# Altium project Motion_Controller.PrjPCB (part 4 of 4)
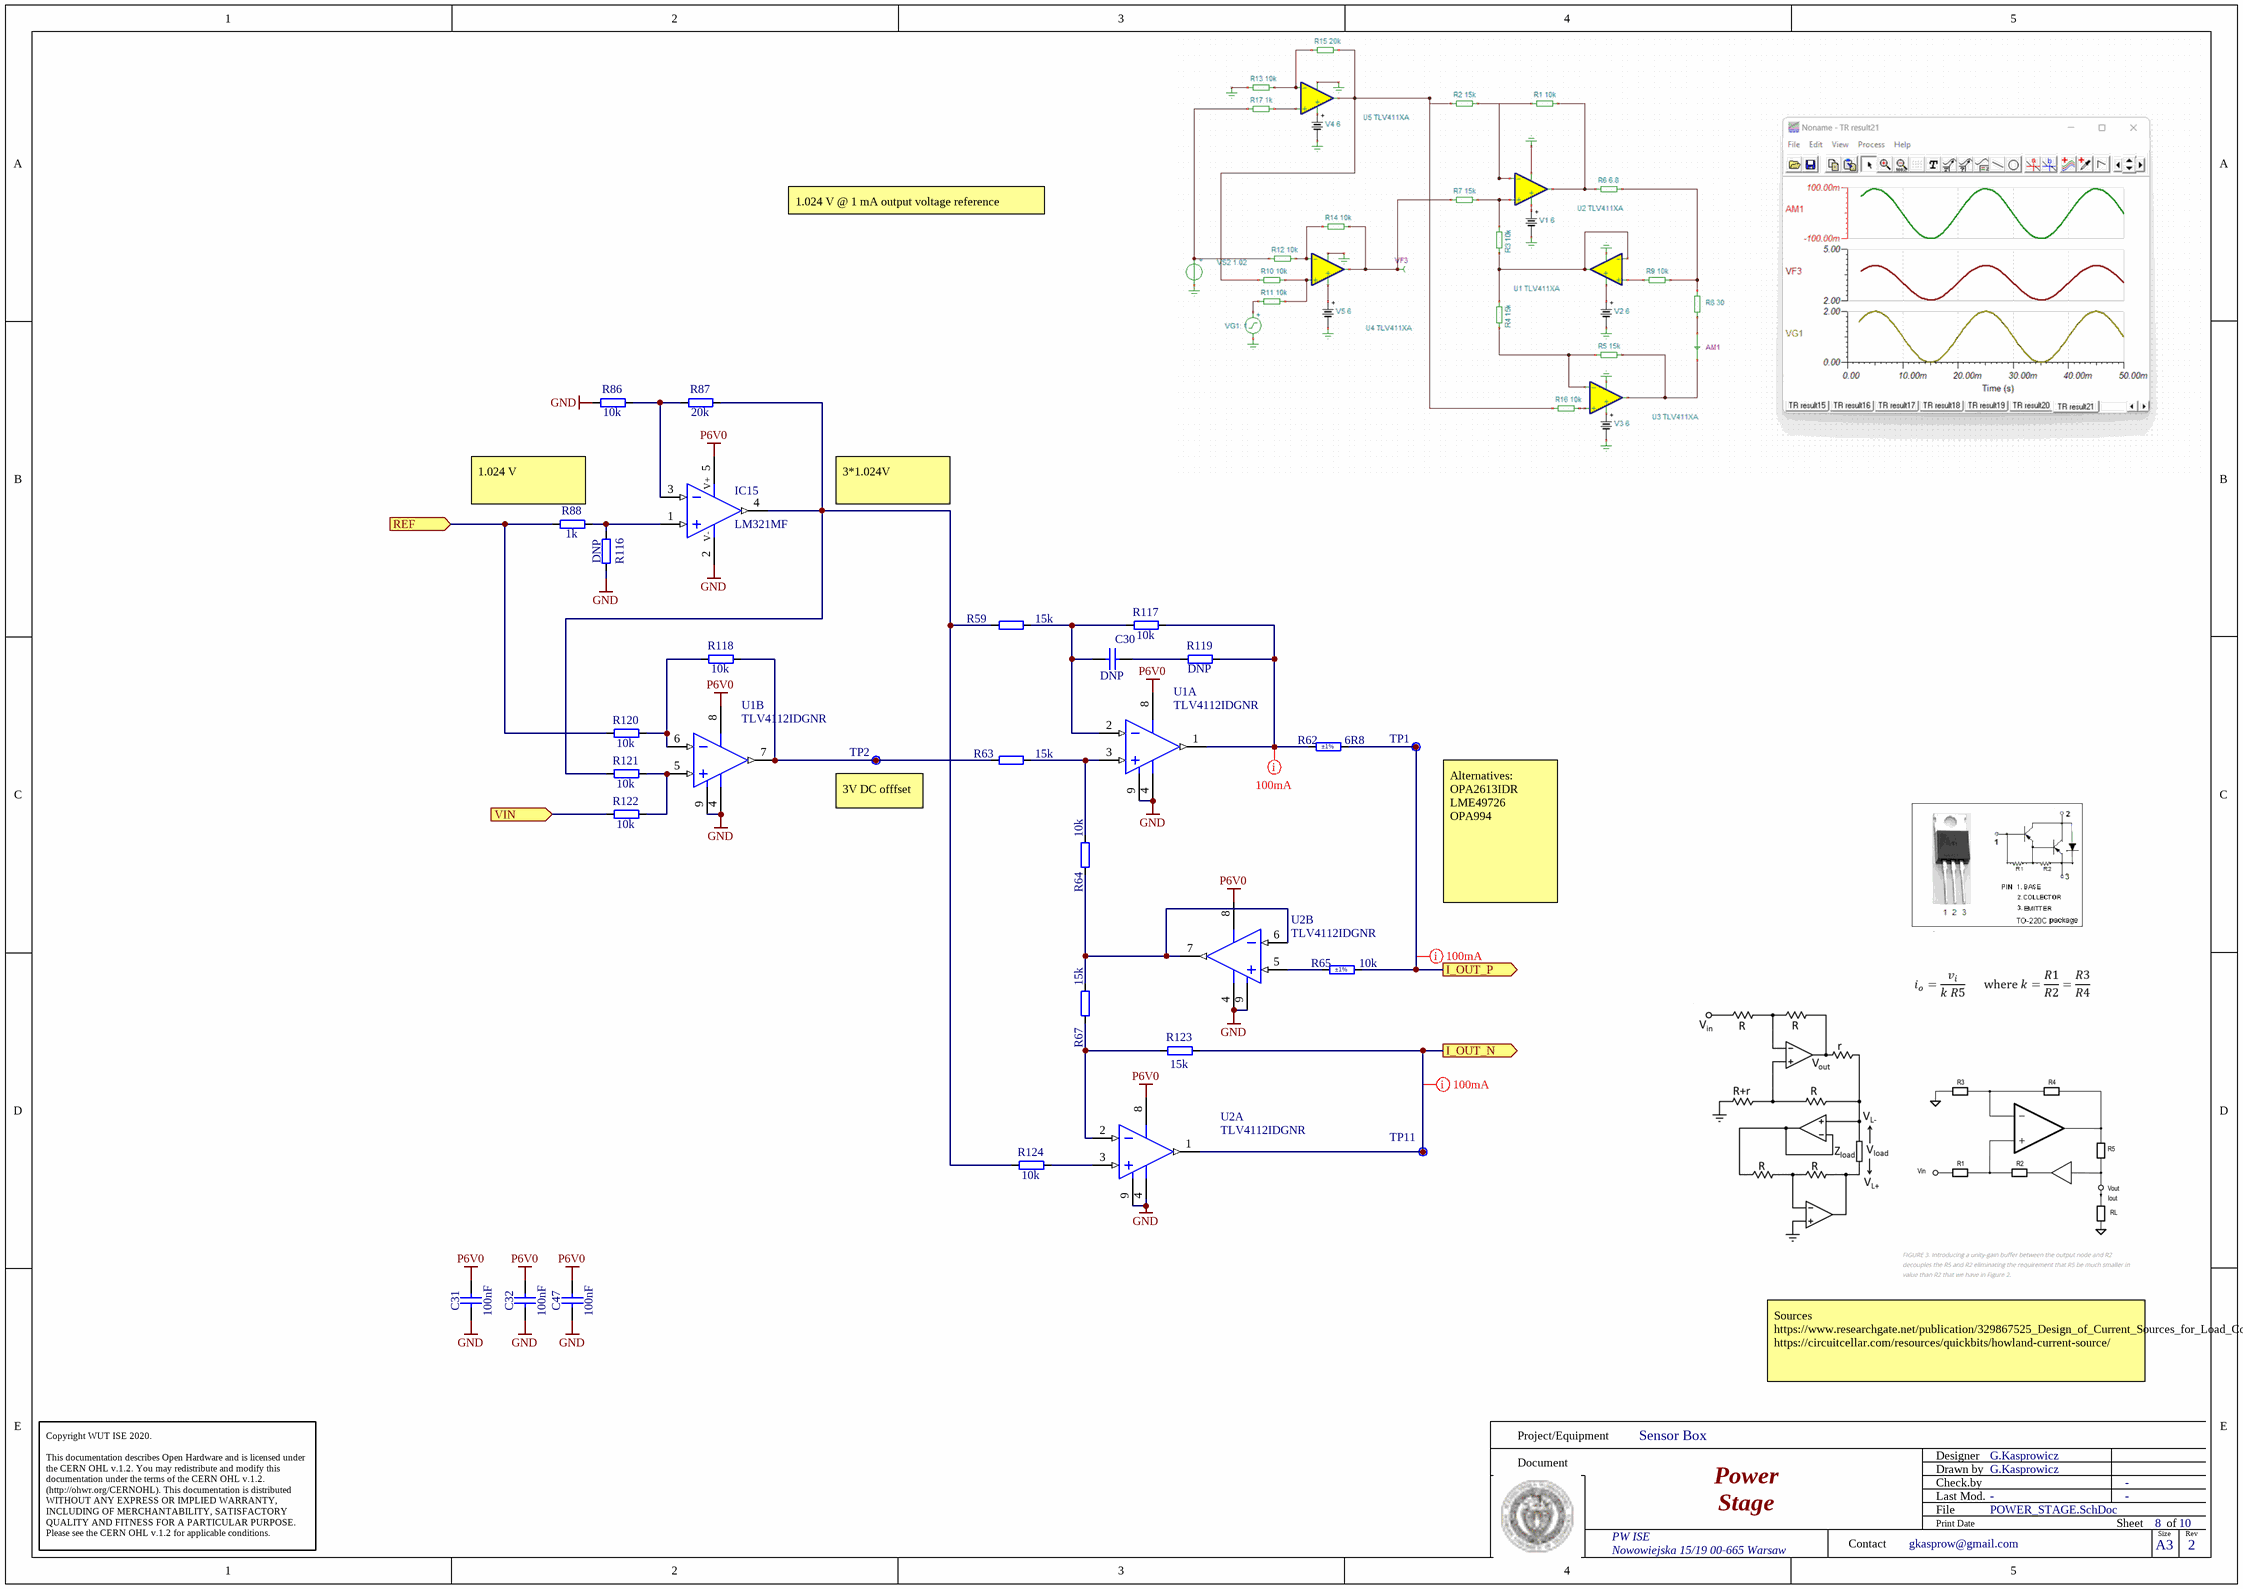
[diagram p11: POWER_STAGE.SchDoc]

## Nets that join several sheets
GND: TOP (6 pins), DAC1 (5 pins), DAC2 (5 pins), DAC3 (5 pins), DAC4 (5 pins), DAC5 (5 pins), DAC6 (5 pins), DAC7 (5 pins), DAC8 (5 pins), CMOD_A7 (14 pins), ARDUINO (12 pins), EEM_CONN (30 pins), DIOT_CONN (37 pins), POWER (34 pins), RJ45 (9 pins), U_RJ45/ENC1 (7 pins), U_RJ45/ENC2 (7 pins), U_RJ45/ENC3 (7 pins), U_RJ45/ENC4 (7 pins), U_RJ45/ENC5 (7 pins), U_RJ45/ENC6 (7 pins), U_RJ45/ENC7 (7 pins), U_RJ45/ENC8 (7 pins), SIN_CH1 (10 pins), SIN_CH2 (10 pins), SIN_CH3 (10 pins), SIN_CH4 (10 pins), SIN_CH5 (10 pins), SIN_CH6 (10 pins), SIN_CH7 (10 pins), SIN_CH8 (10 pins), COS_CH1 (10 pins), COS_CH2 (10 pins), COS_CH3 (10 pins), COS_CH4 (10 pins), COS_CH5 (10 pins), COS_CH6 (10 pins), COS_CH7 (10 pins), COS_CH8 (10 pins)
P3V3: TOP (LD5.2), DAC1 (C38A.2 U3A.8), DAC2 (C38B.2 U3B.8), DAC3 (C38C.2 U3C.8), DAC4 (C38D.2 U3D.8), DAC5 (C38E.2 U3E.8), DAC6 (C38F.2 U3F.8), DAC7 (C38G.2 U3G.8), DAC8 (C38H.2 U3H.8), CMOD_A7 (10 pins), ARDUINO (R99.2), EEM_CONN (8 pins), POWER (8 pins), U_RJ45/ENC1 (R79A.2), U_RJ45/ENC2 (R79B.2), U_RJ45/ENC3 (R79C.2), U_RJ45/ENC4 (R79D.2), U_RJ45/ENC5 (R79E.2), U_RJ45/ENC6 (R79F.2), U_RJ45/ENC7 (R79G.2), U_RJ45/ENC8 (R79H.2)
P3V3_CPCIS: DIOT_CONN (13 pins), POWER (5 pins)
P3V3_MP: TOP (R115.1), ARDUINO (D10.1 R98.2), EEM_CONN (15 pins), POWER (D6.1 D7.1)
P5V0: ARDUINO (R97.2), POWER (7 pins), U_RJ45/ENC1 (P1A.3 R77A.1), U_RJ45/ENC2 (P1B.3 R77B.1), U_RJ45/ENC3 (P1C.3 R77C.1), U_RJ45/ENC4 (P1D.3 R77D.1), U_RJ45/ENC5 (P1E.3 R77E.1), U_RJ45/ENC6 (P1F.3 R77F.1), U_RJ45/ENC7 (P1G.3 R77G.1), U_RJ45/ENC8 (P1H.3 R77H.1)
P6V0: ARDUINO (R84.2), DIOT_CONN (R60.1), POWER (6 pins), SIN_CH1 (6 pins), SIN_CH2 (6 pins), SIN_CH3 (6 pins), SIN_CH4 (6 pins), SIN_CH5 (6 pins), SIN_CH6 (6 pins), SIN_CH7 (6 pins), SIN_CH8 (6 pins), COS_CH1 (6 pins), COS_CH2 (6 pins), COS_CH3 (6 pins), COS_CH4 (6 pins), COS_CH5 (6 pins), COS_CH6 (6 pins), COS_CH7 (6 pins), COS_CH8 (6 pins)
P12V0: ARDUINO (R100.2), EEM_CONN (J2.28 J2.29 R37.1), POWER (11 pins), U_RJ45/ENC1 (C61A.2 IC17A.5), U_RJ45/ENC2 (C61B.2 IC17B.5), U_RJ45/ENC3 (C61C.2 IC17C.5), U_RJ45/ENC4 (C61D.2 IC17D.5), U_RJ45/ENC5 (C61E.2 IC17E.5), U_RJ45/ENC6 (C61F.2 IC17F.5), U_RJ45/ENC7 (C61G.2 IC17G.5), U_RJ45/ENC8 (C61H.2 IC17H.5)
P12V0_CPCIS: EEM_CONN (R37.2), DIOT_CONN (7 pins), POWER (C10.2 IC9.1 IC9.3)
ARDU_MISO: CMOD_A7 (IC13.19), ARDUINO (PCBM2.15)
ARDU_MOSI: CMOD_A7 (IC13.13), ARDUINO (PCBM2.14)
ARDU_MUX: CMOD_A7 (IC13.1 R74.2 R76.2), ARDUINO (PCBM2.7)
ARDU_MUX_OE: CMOD_A7 (IC13.10 R73.2 R75.2), ARDUINO (PCBM2.6)
ARDU_nCS: CMOD_A7 (IC13.11), ARDUINO (PCBM2.12)
ARDU_SCK: CMOD_A7 (IC13.17), ARDUINO (PCBM2.16)
BP_IO.LVDS_N0: EEM_CONN (R13.2), DIOT_CONN (J1.E3)
BP_IO.LVDS_N1: EEM_CONN (R15.2), DIOT_CONN (J1.B3)
BP_IO.LVDS_N2: EEM_CONN (R18.2), DIOT_CONN (J1.C4)
BP_IO.LVDS_N3: EEM_CONN (R22.2), DIOT_CONN (J1.L4)
BP_IO.LVDS_N4: EEM_CONN (R25.2), DIOT_CONN (J1.I4)
BP_IO.LVDS_N5: EEM_CONN (R27.2), DIOT_CONN (J1.K5)
BP_IO.LVDS_N6: EEM_CONN (R29.2), DIOT_CONN (J1.H5)
BP_IO.LVDS_N7: EEM_CONN (R33.2), DIOT_CONN (J1.F6)
BP_IO.LVDS_P0: EEM_CONN (R12.2), DIOT_CONN (J1.D3)
BP_IO.LVDS_P1: EEM_CONN (R14.2), DIOT_CONN (J1.A3)
BP_IO.LVDS_P2: EEM_CONN (R16.2), DIOT_CONN (J1.B4)
BP_IO.LVDS_P3: EEM_CONN (R20.2), DIOT_CONN (J1.K4)
BP_IO.LVDS_P4: EEM_CONN (R24.2), DIOT_CONN (J1.H4)
BP_IO.LVDS_P5: EEM_CONN (R26.2), DIOT_CONN (J1.J5)
BP_IO.LVDS_P6: EEM_CONN (R28.2), DIOT_CONN (J1.G5)
BP_IO.LVDS_P7: EEM_CONN (R32.2), DIOT_CONN (J1.E6)
DAC_DIN1: DAC1 (C35A.2 R70A.1 TP14A.1), CMOD_A7 (PCBM1.3)
DAC_DIN2: DAC2 (C35B.2 R70B.1 TP14B.1), CMOD_A7 (PCBM1.4)
DAC_DIN3: DAC3 (C35C.2 R70C.1 TP14C.1), CMOD_A7 (PCBM1.8)
DAC_DIN4: DAC4 (C35D.2 R70D.1 TP14D.1), CMOD_A7 (PCBM1.11)
DAC_DIN5: DAC5 (C35E.2 R70E.1 TP14E.1), CMOD_A7 (PCBM1.14)
DAC_DIN6: DAC6 (C35F.2 R70F.1 TP14F.1), CMOD_A7 (PCBM1.19)
DAC_DIN7: DAC7 (C35G.2 R70G.1 TP14G.1), CMOD_A7 (PCBM1.22)
DAC_DIN8: DAC8 (C35H.2 R70H.1 TP14H.1), CMOD_A7 (PCBM1.26)
DAC_nCS: TOP (TP16.1), DAC1 (C36A.2 R71A.1), DAC2 (C36B.2 R71B.1), DAC3 (C36C.2 R71C.1), DAC4 (C36D.2 R71D.1), DAC5 (C36E.2 R71E.1), DAC6 (C36F.2 R71F.1), DAC7 (C36G.2 R71G.1), DAC8 (C36H.2 R71H.1), CMOD_A7 (PCBM1.1)
DAC_OUTA1: DAC1 (TP13A.1 U3A.4), SIN_CH1 (R122A.1)
DAC_OUTA2: DAC2 (TP13B.1 U3B.4), SIN_CH2 (R122B.1)
DAC_OUTA3: DAC3 (TP13C.1 U3C.4), SIN_CH3 (R122C.1)
DAC_OUTA4: DAC4 (TP13D.1 U3D.4), SIN_CH4 (R122D.1)
DAC_OUTA5: DAC5 (TP13E.1 U3E.4), SIN_CH5 (R122E.1)
DAC_OUTA6: DAC6 (TP13F.1 U3F.4), SIN_CH6 (R122F.1)
DAC_OUTA7: DAC7 (TP13G.1 U3G.4), SIN_CH7 (R122G.1)
DAC_OUTA8: DAC8 (TP13H.1 U3H.4), SIN_CH8 (R122H.1)
DAC_OUTB1: DAC1 (TP15A.1 U3A.7), COS_CH1 (R122I.1)
DAC_OUTB2: DAC2 (TP15B.1 U3B.7), COS_CH2 (R122J.1)
DAC_OUTB3: DAC3 (TP15C.1 U3C.7), COS_CH3 (R122K.1)
DAC_OUTB4: DAC4 (TP15D.1 U3D.7), COS_CH4 (R122L.1)
DAC_OUTB5: DAC5 (TP15E.1 U3E.7), COS_CH5 (R122M.1)
DAC_OUTB6: DAC6 (TP15F.1 U3F.7), COS_CH6 (R122N.1)
DAC_OUTB7: DAC7 (TP15G.1 U3G.7), COS_CH7 (R122O.1)
DAC_OUTB8: DAC8 (TP15H.1 U3H.7), COS_CH8 (R122P.1)
DAC_REF1: DAC1 (C37A.2 U3A.6), SIN_CH1 (R88A.1 R120A.1), COS_CH1 (R88I.1 R120I.1)
DAC_REF2: DAC2 (C37B.2 U3B.6), SIN_CH2 (R88B.1 R120B.1), COS_CH2 (R88J.1 R120J.1)
DAC_REF3: DAC3 (C37C.2 U3C.6), SIN_CH3 (R88C.1 R120C.1), COS_CH3 (R88K.1 R120K.1)
DAC_REF4: DAC4 (C37D.2 U3D.6), SIN_CH4 (R88D.1 R120D.1), COS_CH4 (R88L.1 R120L.1)
DAC_REF5: DAC5 (C37E.2 U3E.6), SIN_CH5 (R88E.1 R120E.1), COS_CH5 (R88M.1 R120M.1)
DAC_REF6: DAC6 (C37F.2 U3F.6), SIN_CH6 (R88F.1 R120F.1), COS_CH6 (R88N.1 R120N.1)
DAC_REF7: DAC7 (C37G.2 U3G.6), SIN_CH7 (R88G.1 R120G.1), COS_CH7 (R88O.1 R120O.1)
DAC_REF8: DAC8 (C37H.2 U3H.6), SIN_CH8 (R88H.1 R120H.1), COS_CH8 (R88P.1 R120P.1)
DAC_SCLK: TOP (TP12.1), DAC1 (R69A.1), DAC2 (R69B.1), DAC3 (R69C.1), DAC4 (R69D.1), DAC5 (R69E.1), DAC6 (R69F.1), DAC7 (R69G.1), DAC8 (R69H.1), CMOD_A7 (PCBM1.2)
EN_P3V3: EEM_CONN (R42.2 R45.2), POWER (R66.1)
ENC_A1: CMOD_A7 (PCBM1.47), U_RJ45/ENC1 (C60A.2 R81A.1 TP24A.1)
ENC_A2: CMOD_A7 (PCBM1.43), U_RJ45/ENC2 (C60B.2 R81B.1 TP24B.1)
ENC_A3: CMOD_A7 (PCBM1.6), U_RJ45/ENC3 (C60C.2 R81C.1 TP24C.1)
ENC_A4: CMOD_A7 (PCBM1.9), U_RJ45/ENC4 (C60D.2 R81D.1 TP24D.1)
ENC_A5: CMOD_A7 (PCBM1.34), U_RJ45/ENC5 (C60E.2 R81E.1 TP24E.1)
ENC_A6: CMOD_A7 (PCBM1.18), U_RJ45/ENC6 (C60F.2 R81F.1 TP24F.1)
ENC_A7: CMOD_A7 (PCBM1.30), U_RJ45/ENC7 (C60G.2 R81G.1 TP24G.1)
ENC_A8: CMOD_A7 (PCBM1.28), U_RJ45/ENC8 (C60H.2 R81H.1 TP24H.1)
ENC_A_LP1: RJ45 (J4.4UL), U_RJ45/ENC1 (D8A.1 R81A.2)
ENC_A_LP2: RJ45 (J4.4LL), U_RJ45/ENC2 (D8B.1 R81B.2)
ENC_A_LP3: RJ45 (J4.4UCL), U_RJ45/ENC3 (D8C.1 R81C.2)
ENC_A_LP4: RJ45 (J4.4LCL), U_RJ45/ENC4 (D8D.1 R81D.2)
ENC_A_LP5: RJ45 (J4.4UCR), U_RJ45/ENC5 (D8E.1 R81E.2)
ENC_A_LP6: RJ45 (J4.4LCR), U_RJ45/ENC6 (D8F.1 R81F.2)
ENC_A_LP7: RJ45 (J4.4UR), U_RJ45/ENC7 (D8G.1 R81G.2)
ENC_A_LP8: RJ45 (J4.4LR), U_RJ45/ENC8 (D8H.1 R81H.2)
ENC_B1: CMOD_A7 (PCBM1.48), U_RJ45/ENC1 (C55A.2 R82A.1 TP25A.1)
ENC_B2: CMOD_A7 (PCBM1.41), U_RJ45/ENC2 (C55B.2 R82B.1 TP25B.1)
ENC_B3: CMOD_A7 (PCBM1.40), U_RJ45/ENC3 (C55C.2 R82C.1 TP25C.1)
ENC_B4: CMOD_A7 (PCBM1.10), U_RJ45/ENC4 (C55D.2 R82D.1 TP25D.1)
ENC_B5: CMOD_A7 (PCBM1.13), U_RJ45/ENC5 (C55E.2 R82E.1 TP25E.1)
ENC_B6: CMOD_A7 (PCBM1.32), U_RJ45/ENC6 (C55F.2 R82F.1 TP25F.1)
ENC_B7: CMOD_A7 (PCBM1.21), U_RJ45/ENC7 (C55G.2 R82G.1 TP25G.1)
ENC_B8: CMOD_A7 (PCBM1.27), U_RJ45/ENC8 (C55H.2 R82H.1 TP25H.1)
ENC_B_LP1: RJ45 (J4.7UL), U_RJ45/ENC1 (D8A.2 R82A.2)
ENC_B_LP2: RJ45 (J4.7LL), U_RJ45/ENC2 (D8B.2 R82B.2)
ENC_B_LP3: RJ45 (J4.7UCL), U_RJ45/ENC3 (D8C.2 R82C.2)
ENC_B_LP4: RJ45 (J4.7LCL), U_RJ45/ENC4 (D8D.2 R82D.2)
ENC_B_LP5: RJ45 (J4.7UCR), U_RJ45/ENC5 (D8E.2 R82E.2)
ENC_B_LP6: RJ45 (J4.7LCR), U_RJ45/ENC6 (D8F.2 R82F.2)
ENC_B_LP7: RJ45 (J4.7UR), U_RJ45/ENC7 (D8G.2 R82G.2)
ENC_B_LP8: RJ45 (J4.7LR), U_RJ45/ENC8 (D8H.2 R82H.2)
ENC_R1: CMOD_A7 (PCBM1.46), U_RJ45/ENC1 (IC17A.4 R78A.1 R79A.1 TP22A.1)
ENC_R2: CMOD_A7 (PCBM1.45), U_RJ45/ENC2 (IC17B.4 R78B.1 R79B.1 TP22B.1)
ENC_R3: CMOD_A7 (PCBM1.5), U_RJ45/ENC3 (IC17C.4 R78C.1 R79C.1 TP22C.1)
ENC_R4: CMOD_A7 (PCBM1.7), U_RJ45/ENC4 (IC17D.4 R78D.1 R79D.1 TP22D.1)
ENC_R5: CMOD_A7 (PCBM1.12), U_RJ45/ENC5 (IC17E.4 R78E.1 R79E.1 TP22E.1)
ENC_R6: CMOD_A7 (PCBM1.17), U_RJ45/ENC6 (IC17F.4 R78F.1 R79F.1 TP22F.1)
ENC_R7: CMOD_A7 (PCBM1.20), U_RJ45/ENC7 (IC17G.4 R78G.1 R79G.1 TP22G.1)
ENC_R8: CMOD_A7 (PCBM1.23), U_RJ45/ENC8 (IC17H.4 R78H.1 R79H.1 TP22H.1)
I2C_SCL.CPCIS: EEM_CONN (R39.2), DIOT_CONN (IC1.9 IC1.10)
I2C_SDA.CPCIS: EEM_CONN (R38.2), DIOT_CONN (IC1.2 IC1.3)
I_OUT_A_N1: RJ45 (J4.2UL), SIN_CH1 (R123A.2 TP11A.1 U2A.1)
I_OUT_A_N2: RJ45 (J4.2LL), SIN_CH2 (R123B.2 TP11B.1 U2B.1)
I_OUT_A_N3: RJ45 (J4.2UCL), SIN_CH3 (R123C.2 TP11C.1 U2C.1)
I_OUT_A_N4: RJ45 (J4.2LCL), SIN_CH4 (R123D.2 TP11D.1 U2D.1)
I_OUT_A_N5: RJ45 (J4.2UCR), SIN_CH5 (R123E.2 TP11E.1 U2E.1)
I_OUT_A_N6: RJ45 (J4.2LCR), SIN_CH6 (R123F.2 TP11F.1 U2F.1)
I_OUT_A_N7: RJ45 (J4.2UR), SIN_CH7 (R123G.2 TP11G.1 U2G.1)
I_OUT_A_N8: RJ45 (J4.2LR), SIN_CH8 (R123H.2 TP11H.1 U2H.1)
I_OUT_A_P1: RJ45 (J4.1UL), SIN_CH1 (R62A.2 R65A.2 TP1A.1)
I_OUT_A_P2: RJ45 (J4.1LL), SIN_CH2 (R62B.2 R65B.2 TP1B.1)
I_OUT_A_P3: RJ45 (J4.1UCL), SIN_CH3 (R62C.2 R65C.2 TP1C.1)
I_OUT_A_P4: RJ45 (J4.1LCL), SIN_CH4 (R62D.2 R65D.2 TP1D.1)
I_OUT_A_P5: RJ45 (J4.1UCR), SIN_CH5 (R62E.2 R65E.2 TP1E.1)
I_OUT_A_P6: RJ45 (J4.1LCR), SIN_CH6 (R62F.2 R65F.2 TP1F.1)
I_OUT_A_P7: RJ45 (J4.1UR), SIN_CH7 (R62G.2 R65G.2 TP1G.1)
I_OUT_A_P8: RJ45 (J4.1LR), SIN_CH8 (R62H.2 R65H.2 TP1H.1)
I_OUT_B_N1: RJ45 (J4.6UL), COS_CH1 (R123I.2 TP11I.1 U2I.1)
I_OUT_B_N2: RJ45 (J4.6LL), COS_CH2 (R123J.2 TP11J.1 U2J.1)
I_OUT_B_N3: RJ45 (J4.6UCL), COS_CH3 (R123K.2 TP11K.1 U2K.1)
I_OUT_B_N4: RJ45 (J4.6LCL), COS_CH4 (R123L.2 TP11L.1 U2L.1)
I_OUT_B_N5: RJ45 (J4.6UCR), COS_CH5 (R123M.2 TP11M.1 U2M.1)
I_OUT_B_N6: RJ45 (J4.6LCR), COS_CH6 (R123N.2 TP11N.1 U2N.1)
I_OUT_B_N7: RJ45 (J4.6UR), COS_CH7 (R123O.2 TP11O.1 U2O.1)
I_OUT_B_N8: RJ45 (J4.6LR), COS_CH8 (R123P.2 TP11P.1 U2P.1)
I_OUT_B_P1: RJ45 (J4.3UL), COS_CH1 (R62I.2 R65I.2 TP1I.1)
I_OUT_B_P2: RJ45 (J4.3LL), COS_CH2 (R62J.2 R65J.2 TP1J.1)
I_OUT_B_P3: RJ45 (J4.3UCL), COS_CH3 (R62K.2 R65K.2 TP1K.1)
I_OUT_B_P4: RJ45 (J4.3LCL), COS_CH4 (R62L.2 R65L.2 TP1L.1)
I_OUT_B_P5: RJ45 (J4.3UCR), COS_CH5 (R62M.2 R65M.2 TP1M.1)
I_OUT_B_P6: RJ45 (J4.3LCR), COS_CH6 (R62N.2 R65N.2 TP1N.1)
I_OUT_B_P7: RJ45 (J4.3UR), COS_CH7 (R62O.2 R65O.2 TP1O.1)
I_OUT_B_P8: RJ45 (J4.3LR), COS_CH8 (R62P.2 R65P.2 TP1P.1)
LVDS4: CMOD_A7 (PCBM1.42), EEM_CONN (R23.1)
LVDS5: CMOD_A7 (PCBM1.37), EEM_CONN (R31.1)
LVDS6: CMOD_A7 (PCBM1.39), EEM_CONN (R35.1)
LVDS7: CMOD_A7 (PCBM1.44), EEM_CONN (R36.1)
nCS: CMOD_A7 (IC13.12), EEM_CONN (R19.1)
P5V0_ENC1: RJ45 (J4.8UL), U_RJ45/ENC1 (C51A.2 IC17A.1 R77A.2 R78A.2)
P5V0_ENC2: RJ45 (J4.8LL), U_RJ45/ENC2 (C51B.2 IC17B.1 R77B.2 R78B.2)
P5V0_ENC3: RJ45 (J4.8UCL), U_RJ45/ENC3 (C51C.2 IC17C.1 R77C.2 R78C.2)
P5V0_ENC4: RJ45 (J4.8LCL), U_RJ45/ENC4 (C51D.2 IC17D.1 R77D.2 R78D.2)
P5V0_ENC5: RJ45 (J4.8UCR), U_RJ45/ENC5 (C51E.2 IC17E.1 R77E.2 R78E.2)
P5V0_ENC6: RJ45 (J4.8LCR), U_RJ45/ENC6 (C51F.2 IC17F.1 R77F.2 R78F.2)
P5V0_ENC7: RJ45 (J4.8UR), U_RJ45/ENC7 (C51G.2 IC17G.1 R77G.2 R78G.2)
P5V0_ENC8: RJ45 (J4.8LR), U_RJ45/ENC8 (C51H.2 IC17H.1 R77H.2 R78H.2)
PSU_EN: TOP (R115.2 T2.1), DIOT_CONN (R55.1)
SCK: CMOD_A7 (IC13.18), EEM_CONN (R11.1)
SDI: CMOD_A7 (IC13.20), EEM_CONN (R9.1)
SDO: CMOD_A7 (IC13.14), EEM_CONN (R83.1)

## Assembly variants
DIOT: not fitted C30A C30B C30C C30D C30E C30F C30G C30H C30I C30J C30K C30L C30M C30N C30O C30P C52 C53 CON1 IC6 J1 J2 R73 R74 R119A R119B R119C R119D R119E R119F R119G R119H R119I R119J R119K R119L R119M R119N R119O R119P